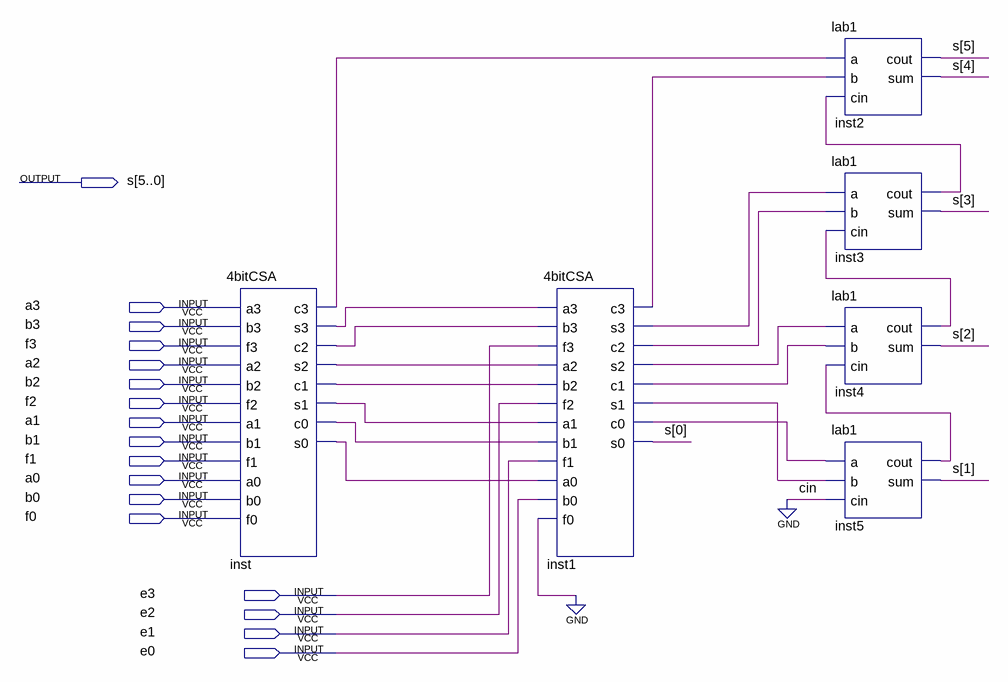
[diagram p0: schematic sheet]
// Quartus schematic 4x4bitCSA.bdf as structural Verilog: 6 symbols, 17 pins
module \4x4bitCSA  (
  input  a3,
  input  b3,
  input  f3,
  input  a2,
  input  b2,
  input  f2,
  input  a1,
  input  b1,
  input  f1,
  input  a0,
  input  b0,
  input  f0,
  input  e3,
  input  e2,
  input  e1,
  input  e0,
  output [5:0] s
);

  wire inst1_c0, inst1_c1, inst1_c2, inst1_c3, inst1_s1, inst1_s2, inst1_s3, inst3_cout, inst4_cout,
       inst5_cout, inst_c0, inst_c1, inst_c2, inst_c3, inst_s0, inst_s1, inst_s2, inst_s3;

  \4bitCSA  inst (
    .a3(a3), .b3(b3), .f3(f3), .a2(a2), .b2(b2), .f2(f2), .a1(a1), .b1(b1), .f1(f1), .a0(a0), .b0(b0),
    .f0(f0), .c3(inst_c3), .s3(inst_s3), .c2(inst_c2), .s2(inst_s2), .c1(inst_c1), .s1(inst_s1),
    .c0(inst_c0), .s0(inst_s0));
  \4bitCSA  inst1 (
    .a3(inst_s3), .b3(inst_c2), .f3(e3), .a2(inst_s2), .b2(inst_c1), .f2(e2), .a1(inst_s1), .b1(inst_c0),
    .f1(e1), .a0(inst_s0), .b0(e0), .f0(1'b0), .c3(inst1_c3), .s3(inst1_s3), .c2(inst1_c2), .s2(inst1_s2),
    .c1(inst1_c1), .s1(inst1_s1), .c0(inst1_c0), .s0(s[0]));
  lab1 inst2 (.a(inst_c3), .b(inst1_c3), .cin(inst3_cout), .cout(s[5]), .sum(s[4]));
  lab1 inst3 (.a(inst1_s3), .b(inst1_c2), .cin(inst4_cout), .cout(inst3_cout), .sum(s[3]));
  lab1 inst4 (.a(inst1_s2), .b(inst1_c1), .cin(inst5_cout), .cout(inst4_cout), .sum(s[2]));
  lab1 inst5 (.a(inst1_c0), .b(inst1_s1), .cin(1'b0), .cout(inst5_cout), .sum(s[1]));
endmodule
